# Altium schematic sheet RAM_EMMC_NOVA.SchDoc
size A3; SheetNumber: 8; SheetTotal: 15
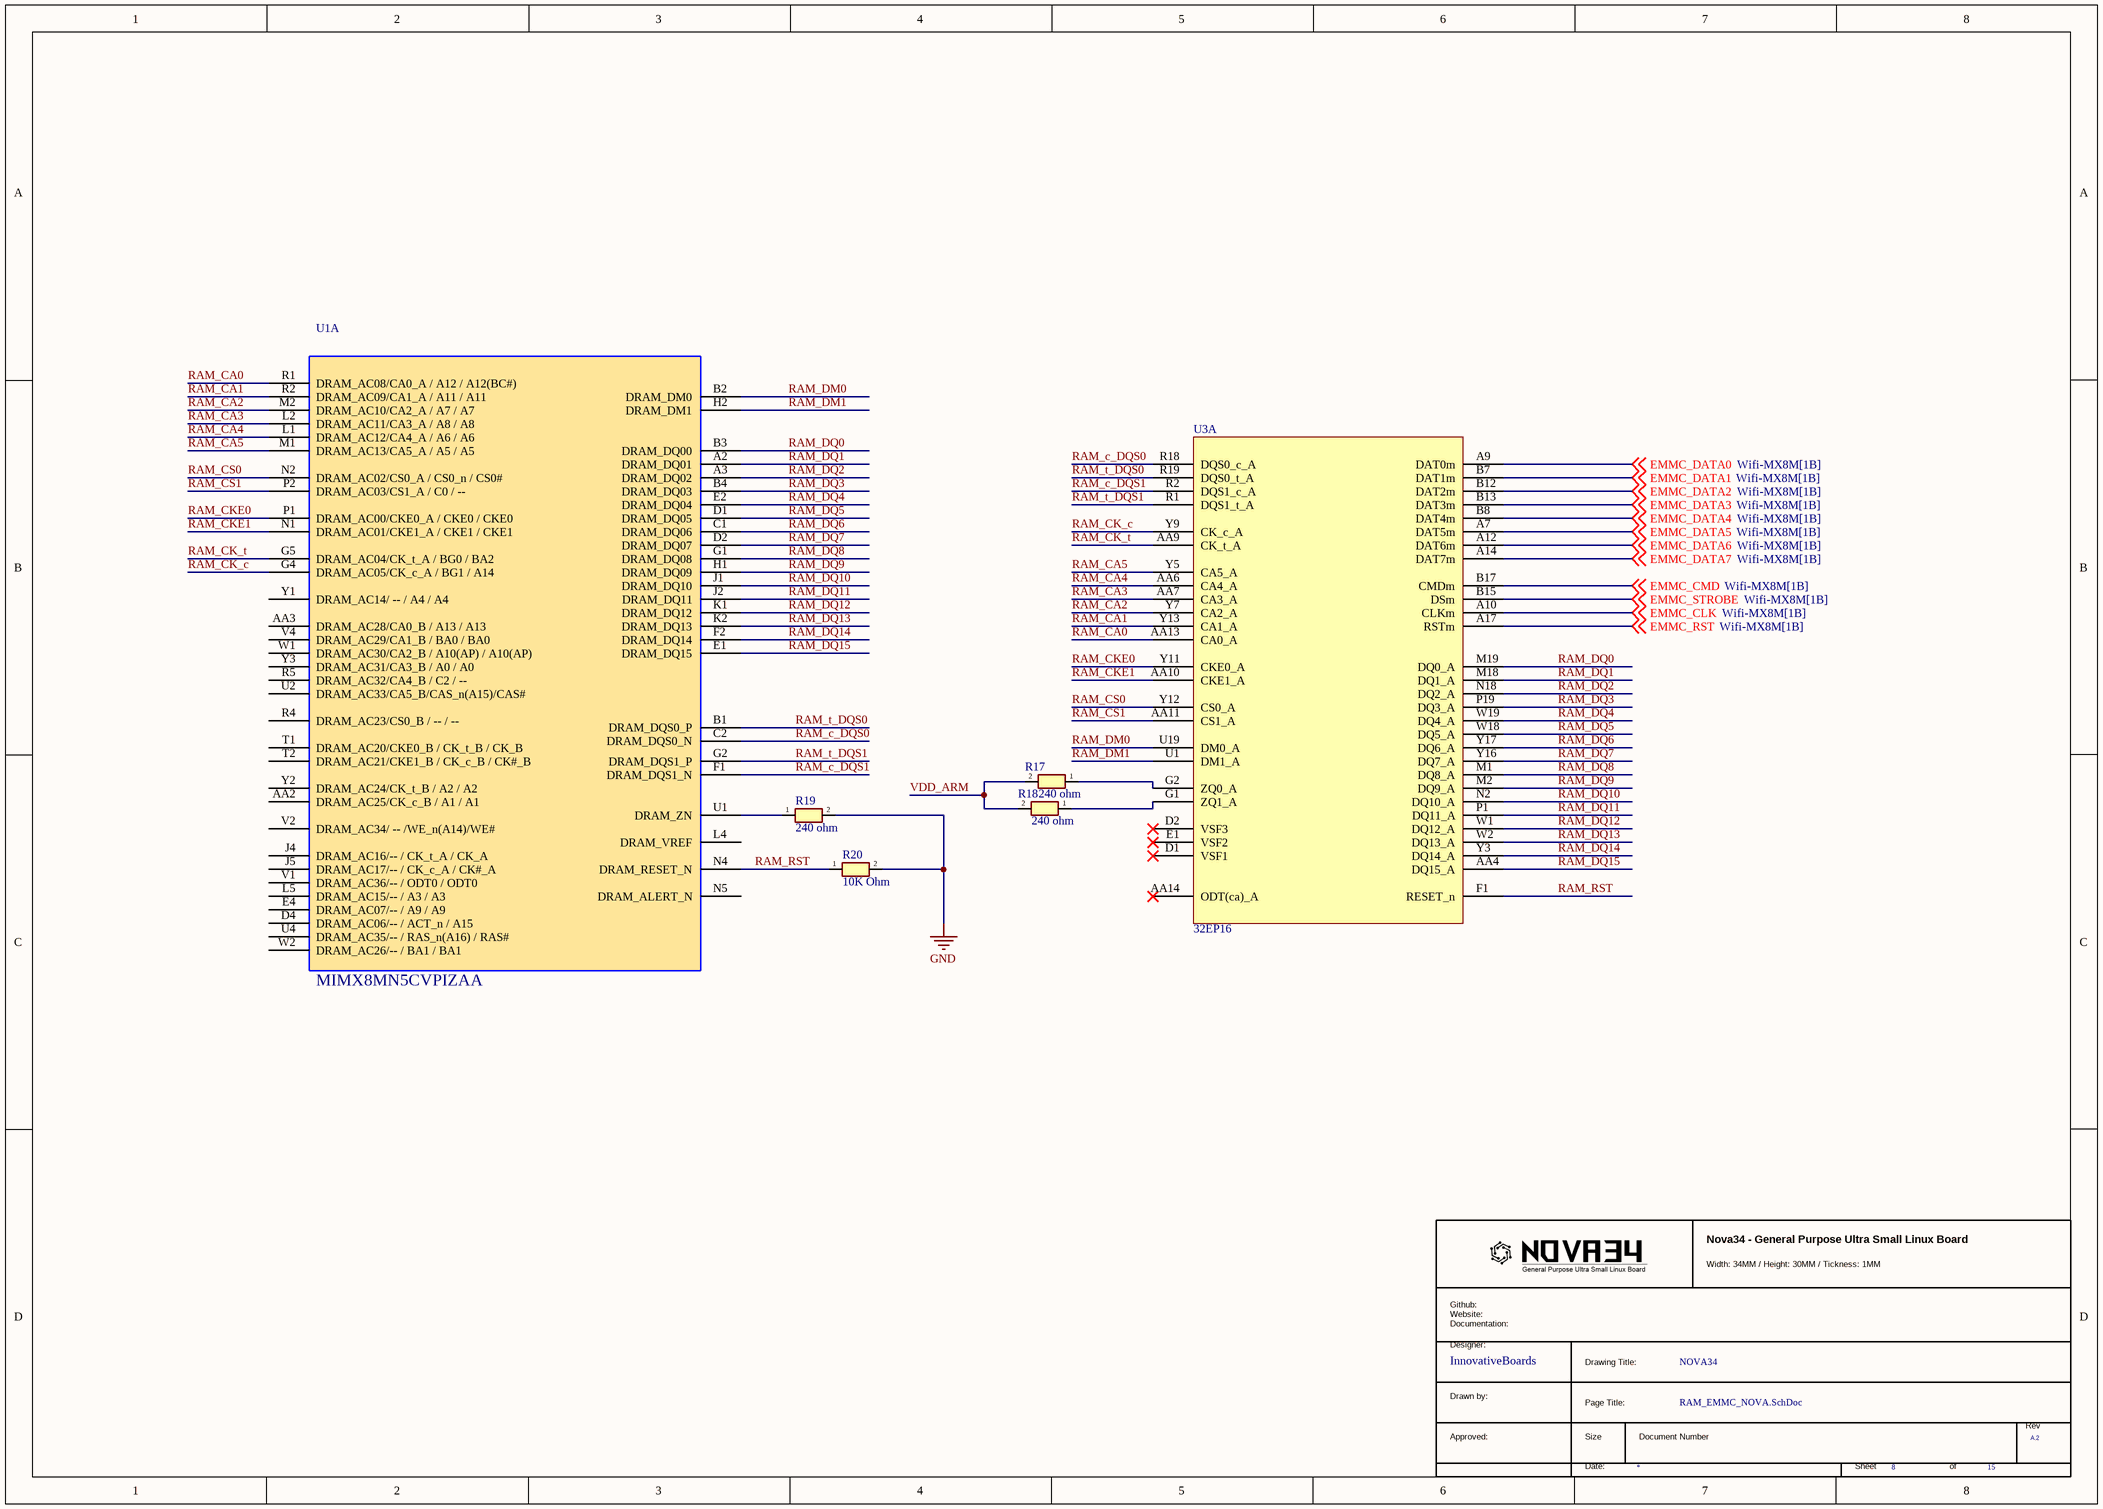
[diagram p0: RAM_EMMC_NOVA.SchDoc]

## Parts
*  RevCode: A.2  (hidden comment: TitleBlock_MCPG)  (graphical)
R17  240 ohm  [RESC0603X26N]
R18  240 ohm  [RESC0603X26N]
R19  240 ohm  [RESC0603X26N]
R20  10K Ohm  [RESC1005X40N]
U1  MIMX8MN5CVPIZAA  [BGA306C50P21X21_1100X1100X101]  (part A of 12)
U3  32EP16  [BGA144C40P19X21_800X950X80]  (part A of 3)

## Nets
GND: R19.2 R20.2
EMMC_CLK: U3.A10(CLKm) ; off-sheet EMMC_CLK
EMMC_CMD: U3.B17(CMDm) ; off-sheet EMMC_CMD
EMMC_DATA0: U3.A9(DAT0m) ; off-sheet EMMC_DATA0
EMMC_DATA1: U3.B7(DAT1m) ; off-sheet EMMC_DATA1
EMMC_DATA2: U3.B12(DAT2m) ; off-sheet EMMC_DATA2
EMMC_DATA3: U3.B13(DAT3m) ; off-sheet EMMC_DATA3
EMMC_DATA4: U3.B8(DAT4m) ; off-sheet EMMC_DATA4
EMMC_DATA5: U3.A7(DAT5m) ; off-sheet EMMC_DATA5
EMMC_DATA6: U3.A12(DAT6m) ; off-sheet EMMC_DATA6
EMMC_DATA7: U3.A14(DAT7m) ; off-sheet EMMC_DATA7
EMMC_RST: U3.A17(RSTm) ; off-sheet EMMC_RST
EMMC_STROBE: U3.B15(DSm) ; off-sheet EMMC_STROBE
RAM_c_DQS0: U1.C2(DRAM_DQS0_N) U3.R18(DQS0_c_A)
RAM_c_DQS1: U1.F1(DRAM_DQS1_N) U3.R2(DQS1_c_A)
RAM_CA0: U1.R1(DRAM_AC08/CA0_A_/_A12_/_A12(BC#)) U3.AA13(CA0_A)
RAM_CA1: U1.R2(DRAM_AC09/CA1_A_/_A11_/_A11) U3.Y13(CA1_A)
RAM_CA2: U1.M2(DRAM_AC10/CA2_A_/_A7_/_A7) U3.Y7(CA2_A)
RAM_CA3: U1.L2(DRAM_AC11/CA3_A_/_A8_/_A8) U3.AA7(CA3_A)
RAM_CA4: U1.L1(DRAM_AC12/CA4_A_/_A6_/_A6) U3.AA6(CA4_A)
RAM_CA5: U1.M1(DRAM_AC13/CA5_A_/_A5_/_A5) U3.Y5(CA5_A)
RAM_CK_c: U1.G4(DRAM_AC05/CK_c_A_/_BG1_/_A14) U3.Y9(CK_c_A)
RAM_CK_t: U1.G5(DRAM_AC04/CK_t_A_/_BG0_/_BA2) U3.AA9(CK_t_A)
RAM_CKE0: U1.P1(DRAM_AC00/CKE0_A_/_CKE0_/_CKE0) U3.Y11(CKE0_A)
RAM_CKE1: U1.N1(DRAM_AC01/CKE1_A_/_CKE1_/_CKE1) U3.AA10(CKE1_A)
RAM_CS0: U1.N2(DRAM_AC02/CS0_A_/_CS0_n_/_CS0#) U3.Y12(CS0_A)
RAM_CS1: U1.P2(DRAM_AC03/CS1_A_/_C0_/_--) U3.AA11(CS1_A)
RAM_DM0: U1.B2(DRAM_DM0) U3.U19(DM0_A)
RAM_DM1: U1.H2(DRAM_DM1) U3.U1(DM1_A)
RAM_DQ0: U1.B3(DRAM_DQ00) U3.M19(DQ0_A)
RAM_DQ1: U1.A2(DRAM_DQ01) U3.M18(DQ1_A)
RAM_DQ2: U1.A3(DRAM_DQ02) U3.N18(DQ2_A)
RAM_DQ3: U1.B4(DRAM_DQ03) U3.P19(DQ3_A)
RAM_DQ4: U1.E2(DRAM_DQ04) U3.W19(DQ4_A)
RAM_DQ5: U1.D1(DRAM_DQ05) U3.W18(DQ5_A)
RAM_DQ6: U1.C1(DRAM_DQ06) U3.Y17(DQ6_A)
RAM_DQ7: U1.D2(DRAM_DQ07) U3.Y16(DQ7_A)
RAM_DQ8: U1.G1(DRAM_DQ08) U3.M1(DQ8_A)
RAM_DQ9: U1.H1(DRAM_DQ09) U3.M2(DQ9_A)
RAM_DQ10: U1.J1(DRAM_DQ10) U3.N2(DQ10_A)
RAM_DQ11: U1.J2(DRAM_DQ11) U3.P1(DQ11_A)
RAM_DQ12: U1.K1(DRAM_DQ12) U3.W1(DQ12_A)
RAM_DQ13: U1.K2(DRAM_DQ13) U3.W2(DQ13_A)
RAM_DQ14: U1.F2(DRAM_DQ14) U3.Y3(DQ14_A)
RAM_DQ15: U1.E1(DRAM_DQ15) U3.AA4(DQ15_A)
RAM_RST: R20.1 U1.N4(DRAM_RESET_N) U3.F1(RESET_n)
RAM_t_DQS0: U1.B1(DRAM_DQS0_P) U3.R19(DQS0_t_A)
RAM_t_DQS1: U1.G2(DRAM_DQS1_P) U3.R1(DQS1_t_A)
VDD_ARM: R17.2 R18.2
NetR17_1: R17.1 U3.G2(ZQ0_A)
NetR18_1: R18.1 U3.G1(ZQ1_A)
NetR19_1: R19.1 U1.U1(DRAM_ZN)

Not connected (* = marked no-connect by the designer): U1 AA2(DRAM_AC25/CK_c_B_/_A1_/_A1) AA3(DRAM_AC28/CA0_B_/_A13_/_A13) D4(DRAM_AC06/--_/_ACT_n_/_A15) E4(DRAM_AC07/--_/_A9_/_A9) J4(DRAM_AC16/--_/_CK_t_A_/_CK_A) J5(DRAM_AC17/--_/_CK_c_A_/_CK#_A) L4(DRAM_VREF) L5(DRAM_AC15/--_/_A3_/_A3) N5(DRAM_ALERT_N) R4(DRAM_AC23/CS0_B_/_--_/_--) R5(DRAM_AC32/CA4_B_/_C2_/_--) T1(DRAM_AC20/CKE0_B_/_CK_t_B_/_CK_B) T2(DRAM_AC21/CKE1_B_/_CK_c_B_/_CK#_B) U2(DRAM_AC33/CA5_B/CAS_n(A15)/CAS#) U4(DRAM_AC35/--_/_RAS_n(A16)_/_RAS#) V1(DRAM_AC36/--_/_ODT0_/_ODT0) V2(DRAM_AC34/_--_/WE_n(A14)/WE#) V4(DRAM_AC29/CA1_B_/_BA0_/_BA0) W1(DRAM_AC30/CA2_B_/_A10(AP)_/_A10(AP)) W2(DRAM_AC26/--_/_BA1_/_BA1) Y1(DRAM_AC14/_--_/_A4_/_A4) Y2(DRAM_AC24/CK_t_B_/_A2_/_A2) Y3(DRAM_AC31/CA3_B_/_A0_/_A0); U3 AA14(ODT(ca)_A)* D1(VSF1)* D2(VSF3)* E1(VSF2)*

## Notes on the sheet
- (in symbol TitleBlock_MCPG) Nova34 - General Purpose Ultra Small Linux Board; Width: 34MM / Height: 30MM / Tickness: 1MM; Github: / Website: / Documentation:; Designer:; InnovativeBoards; Drawing Title:; NOVA34; Drawn by:; Page Title:; Rev; Approved:; Size; Document Number; Date:; Sheet; of

## Library data of the parts
R17-R19 = RC0201FR-07240RL: Resistor; Manufacturer_Name: KEMET; Datasheet Link: http://www.yageo.com/documents/recent/PYu-RC0201_51_RoHS_L_8.pdf; Height: 0.26mm; Manufacturer_Part_Number: RC0201FR-07240RL; Mouser Part Number: 603-RC0201FR-07240RL; Mouser Price/Stock: http://www.mouser.com/Search/ProductDetail.aspx?qs=qUsL5DZkYVqW175bPUdS2w%3d%3d; Arrow Part Number: RC0201FR-07240RL; Arrow Price/Stock: https://www.arrow.com/en/products/rc0201fr-07240rl/yageo
R20 = RC0402FR-0710KL: Resistor; Manufacturer_Name: KEMET; Datasheet Link: http://www.yageo.com/documents/recent/PYu-RC0402_51_RoHS_L_6_r.pdf; Height: 0.4mm; Manufacturer_Part_Number: RC0402FR-0710KL; Mouser Part Number: 603-RC0402FR-0710KL; Mouser Price/Stock: https://www.mouser.co.uk/ProductDetail/YAGEO/RC0402FR-0710KL?qs=I1mnnYJTTsxUoNwrUsQExA%3D%3D; Arrow Part Number: RC0402FR-0710KL; Arrow Price/Stock: https://www.arrow.com/en/products/rc0402fr-0710kl/yageo?region=europe
U1 = MIMX8MN: IC CPU QUAD CORTEX A53+M7 1.4GHZ -- BGA306; PCB Footprint: pbga306_0p5_sq11mm; AGILE_PN: TMP-CIP-5098; CAD_APPROVED: Yes; PRE_APN: 330-77152; Temp Range: -40¡ãC to 105¡ãC; MFG_NAME01: NXP SEMICONDUCTORS; CLASS: IC; HEIGHT: 1.01MM; ROHS: Yes; MFG_PN01: MIMX8MN5CVPIZAA
* = TitleBlock_MCPG: Page Create Date: March  8, 1995